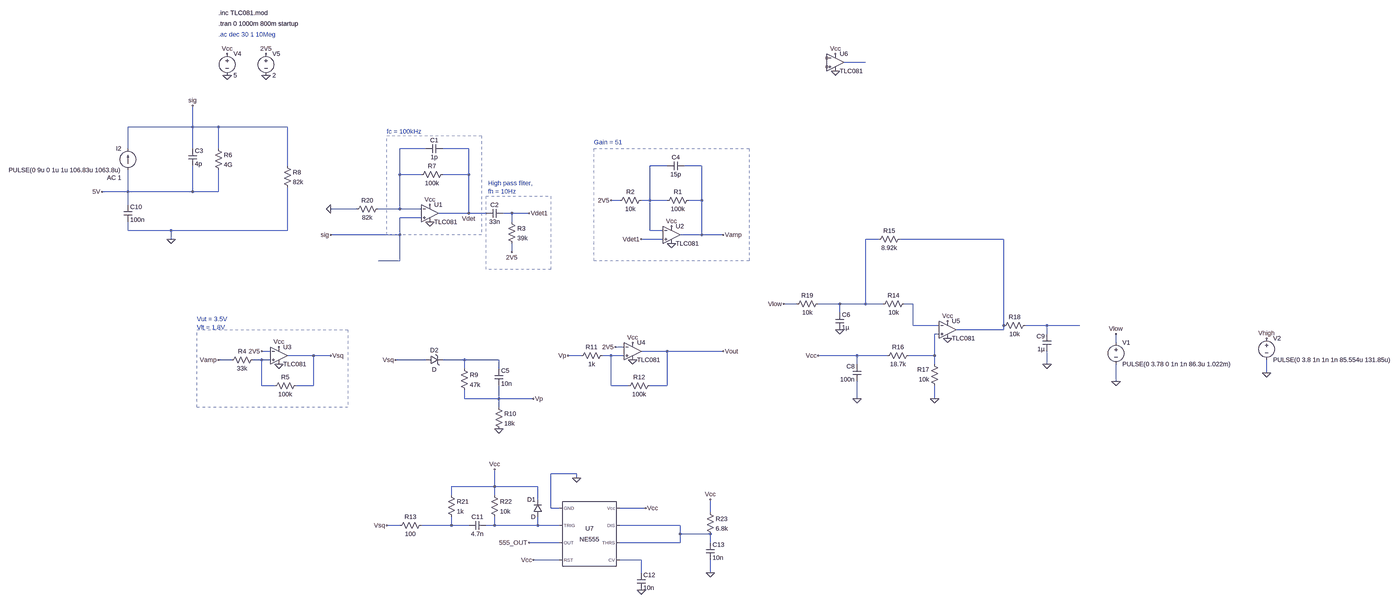
[diagram p0: schematic Receiver_updated - Alexander.asc, whole sheet]
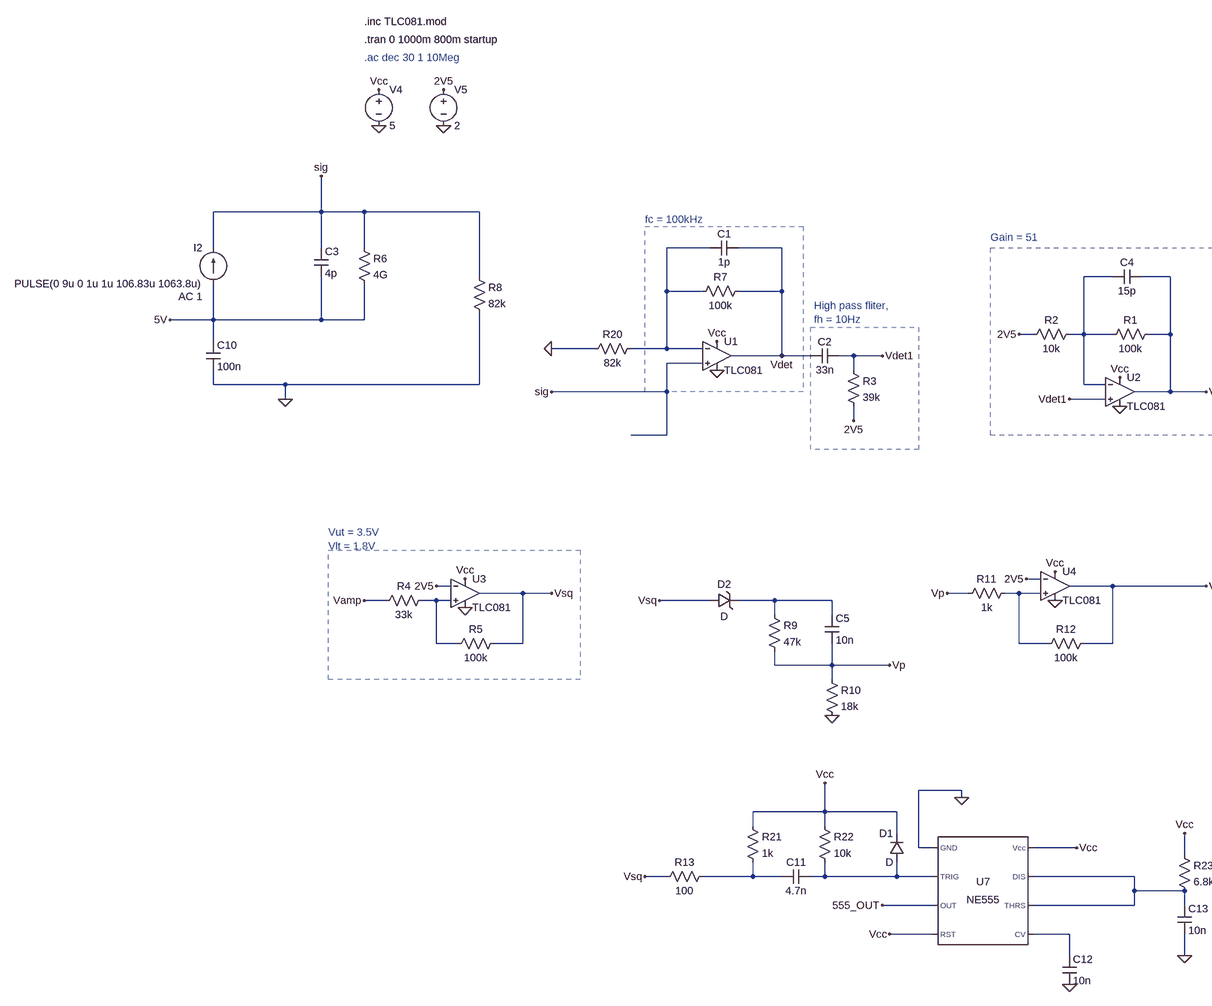
[diagram p1: schematic Receiver_updated - Alexander.asc, part, row 1 of 1, column 1 of 2]
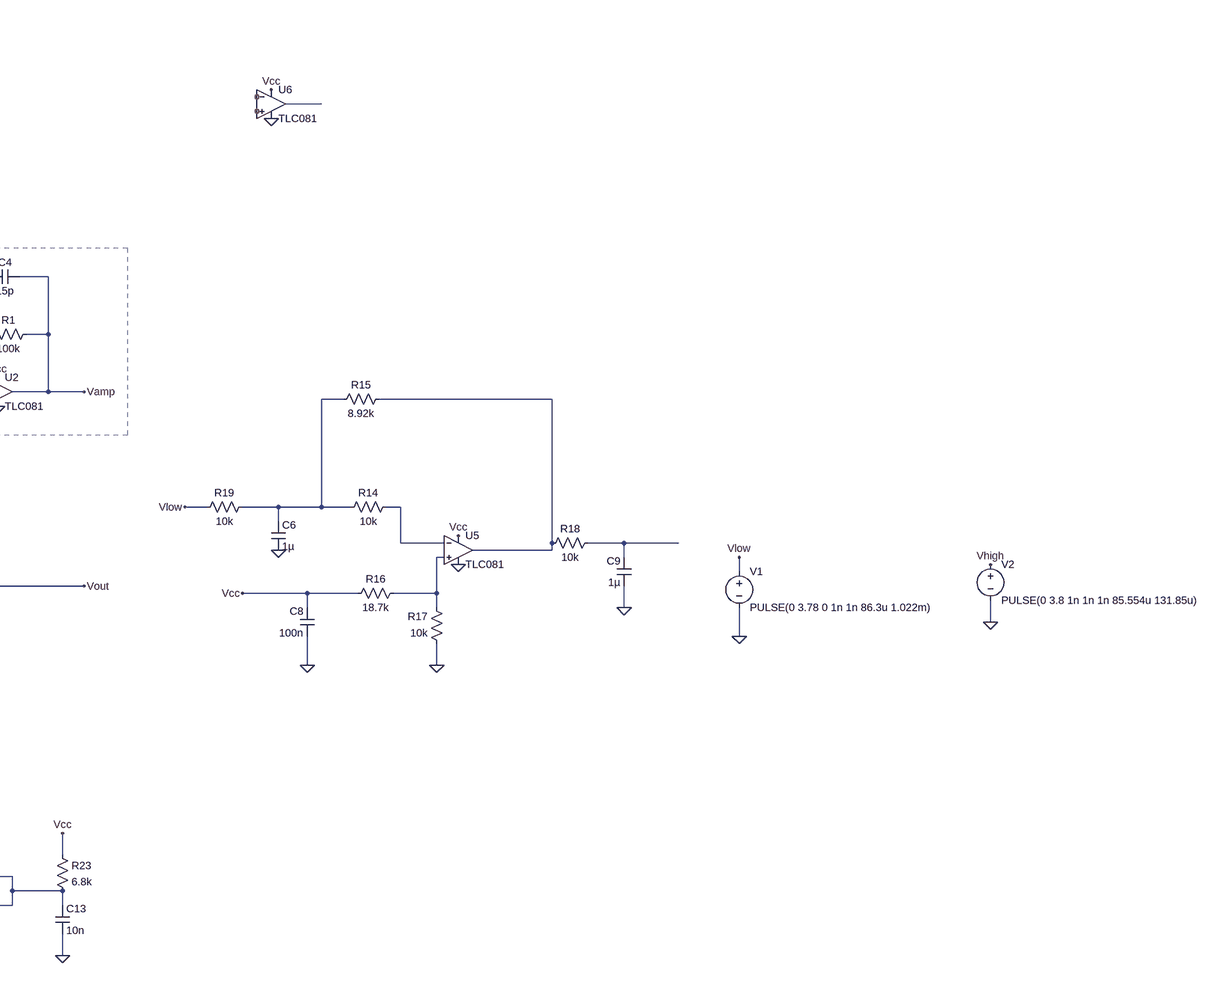
[diagram p2: schematic Receiver_updated - Alexander.asc, part, row 1 of 1, column 2 of 2]
Receiver_updated - Alexander.asc, the LTspice schematic file:
Version 4.1
SHEET 1 5412 2404
WIRE 1408 416 1328 416
WIRE -1088 656 -1088 576
WIRE -1088 656 -1328 656
WIRE -992 656 -1088 656
WIRE -736 656 -992 656
WIRE -1328 736 -1328 656
WIRE -1088 736 -1088 656
WIRE -992 736 -992 656
WIRE -224 736 -320 736
WIRE -64 736 -160 736
WIRE -736 800 -736 656
WIRE 672 800 608 800
WIRE 800 800 736 800
WIRE -320 832 -320 736
WIRE -240 832 -320 832
WIRE -64 832 -64 736
WIRE -64 832 -160 832
WIRE -1328 896 -1328 816
WIRE -1328 896 -1424 896
WIRE -1088 896 -1088 800
WIRE -1088 896 -1328 896
WIRE -992 896 -992 816
WIRE -992 896 -1088 896
WIRE 496 928 464 928
WIRE 608 928 608 800
WIRE 608 928 576 928
WIRE 672 928 608 928
WIRE 800 928 800 800
WIRE 800 928 752 928
WIRE -1328 944 -1328 896
WIRE -480 960 -576 960
WIRE -320 960 -320 832
WIRE -320 960 -400 960
WIRE -240 960 -320 960
WIRE -64 976 -64 832
WIRE -64 976 -176 976
WIRE 0 976 -64 976
WIRE 96 976 64 976
WIRE 160 976 96 976
WIRE -240 992 -320 992
WIRE 96 1008 96 976
WIRE -1328 1040 -1328 1008
WIRE -1168 1040 -1328 1040
WIRE -736 1040 -736 880
WIRE -736 1040 -1168 1040
WIRE 608 1040 608 928
WIRE 656 1040 608 1040
WIRE -320 1056 -320 992
WIRE -320 1056 -576 1056
WIRE 800 1056 800 928
WIRE 800 1056 720 1056
WIRE 880 1056 800 1056
WIRE -1168 1072 -1168 1040
WIRE 656 1072 576 1072
WIRE 1456 1072 1408 1072
WIRE 1984 1072 1536 1072
WIRE 96 1120 96 1088
WIRE -320 1152 -320 1056
WIRE -320 1152 -400 1152
WIRE 1152 1312 1104 1312
WIRE 1312 1312 1232 1312
WIRE 1408 1312 1408 1072
WIRE 1408 1312 1312 1312
WIRE 1472 1312 1408 1312
WIRE 1584 1312 1552 1312
WIRE 1312 1344 1312 1312
WIRE 1584 1392 1584 1312
WIRE 1680 1392 1584 1392
WIRE 1984 1392 1984 1072
WIRE 2144 1392 2064 1392
WIRE 2320 1392 2144 1392
WIRE 1984 1408 1984 1392
WIRE 1984 1408 1744 1408
WIRE 1680 1424 1664 1424
WIRE 2144 1424 2144 1392
WIRE 2480 1456 2480 1424
WIRE 512 1472 480 1472
WIRE -800 1488 -832 1488
WIRE 672 1488 576 1488
WIRE 880 1488 672 1488
WIRE -640 1504 -736 1504
WIRE -576 1504 -640 1504
WIRE 352 1504 304 1504
WIRE 464 1504 432 1504
WIRE 512 1504 464 1504
WIRE 1376 1504 1232 1504
WIRE 1488 1504 1376 1504
WIRE 1664 1504 1664 1424
WIRE 1664 1504 1568 1504
WIRE -944 1520 -992 1520
WIRE -832 1520 -864 1520
WIRE -800 1520 -832 1520
WIRE -224 1520 -336 1520
WIRE -80 1520 -160 1520
WIRE 48 1520 -80 1520
WIRE 1376 1536 1376 1504
WIRE 1664 1536 1664 1504
WIRE 2144 1536 2144 1488
WIRE -80 1552 -80 1520
WIRE 48 1552 48 1520
WIRE 3072 1568 3072 1520
WIRE 2480 1600 2480 1536
WIRE -832 1616 -832 1520
WIRE -784 1616 -832 1616
WIRE -640 1616 -640 1504
WIRE -640 1616 -704 1616
WIRE 464 1616 464 1504
WIRE 528 1616 464 1616
WIRE 672 1616 672 1488
WIRE 672 1616 608 1616
WIRE -80 1664 -80 1632
WIRE 48 1664 48 1616
WIRE 48 1664 -80 1664
WIRE 176 1664 48 1664
WIRE 1376 1664 1376 1600
WIRE 1664 1664 1664 1616
WIRE 48 1696 48 1664
WIRE 336 1952 240 1952
WIRE 336 1968 336 1952
WIRE 32 2000 32 1936
WIRE 32 2000 -128 2000
WIRE 192 2000 32 2000
WIRE -128 2032 -128 2000
WIRE 32 2032 32 2000
WIRE 192 2048 192 2000
WIRE 240 2080 240 1952
WIRE 272 2080 240 2080
WIRE 592 2080 496 2080
WIRE 832 2096 832 2048
WIRE -320 2144 -368 2144
WIRE -128 2144 -128 2112
WIRE -128 2144 -240 2144
WIRE -64 2144 -128 2144
WIRE 32 2144 32 2112
WIRE 32 2144 0 2144
WIRE 192 2144 192 2112
WIRE 192 2144 32 2144
WIRE 272 2144 192 2144
WIRE 720 2144 496 2144
WIRE 720 2176 720 2144
WIRE 832 2176 720 2176
WIRE 272 2208 160 2208
WIRE 720 2208 720 2176
WIRE 720 2208 496 2208
WIRE 832 2208 832 2176
WIRE 272 2272 176 2272
WIRE 576 2272 496 2272
WIRE 576 2320 576 2272
WIRE 832 2320 832 2272
FLAG -208 1008 0
FLAG -208 944 Vcc
FLAG -960 464 0
FLAG -960 384 Vcc
FLAG -816 464 0
FLAG -816 384 2V5
FLAG 464 928 2V5
FLAG 688 1088 0
FLAG 688 1024 Vcc
FLAG 576 1072 Vdet1
FLAG 96 1120 2V5
FLAG 160 976 Vdet1
FLAG -64 976 Vdet
FLAG 880 1056 Vamp
FLAG -768 1472 Vcc
FLAG -768 1536 0
FLAG -992 1520 Vamp
FLAG -832 1488 2V5
FLAG -576 1504 Vsq
FLAG 48 1776 0
FLAG -336 1520 Vsq
FLAG 176 1664 Vp
FLAG 304 1504 Vp
FLAG 480 1472 2V5
FLAG 544 1520 0
FLAG 544 1456 Vcc
FLAG -1088 576 sig
FLAG -576 960 0
FLAG -576 1056 sig
FLAG -1424 896 5V
FLAG -1168 1072 0
FLAG 880 1488 Vout
FLAG 1296 448 0
FLAG 1296 384 Vcc
FLAG 1376 1664 0
FLAG 1664 1664 0
FLAG 2144 1536 0
FLAG 1312 1408 0
FLAG 1712 1440 0
FLAG 1712 1376 Vcc
FLAG 1232 1504 Vcc
FLAG -368 2144 Vsq
FLAG 336 1968 0
FLAG 592 2080 Vcc
FLAG 32 1936 Vcc
FLAG 576 2384 0
FLAG 176 2272 Vcc
FLAG 160 2208 555_OUT
FLAG 832 2048 Vcc
FLAG 832 2320 0
FLAG 2480 1424 Vlow
FLAG 2480 1600 0
FLAG 3072 1440 Vhigh
FLAG 3072 1568 0
FLAG 1104 1312 Vlow
SYMBOL cap -1104 736 R0
SYMATTR InstName C3
SYMATTR Value 4p
SYMBOL res -1008 720 R0
SYMATTR InstName R6
SYMATTR Value 4G
SYMBOL res -144 816 R90
WINDOW 0 0 56 VBottom 2
WINDOW 3 32 56 VTop 2
SYMATTR InstName R7
SYMATTR Value 100k
SYMBOL voltage -960 368 R0
SYMATTR InstName V4
SYMATTR Value 5
SYMBOL voltage -816 368 R0
WINDOW 123 0 0 Left 0
WINDOW 39 0 0 Left 0
SYMATTR InstName V5
SYMATTR Value 2
SYMBOL cap -160 720 R90
WINDOW 0 0 32 VBottom 2
WINDOW 3 32 32 VTop 2
SYMATTR InstName C1
SYMATTR Value 1p
SYMBOL res 768 912 R90
WINDOW 0 0 56 VBottom 2
WINDOW 3 32 56 VTop 2
SYMATTR InstName R1
SYMATTR Value 100k
SYMBOL res 592 912 R90
WINDOW 0 0 56 VBottom 2
WINDOW 3 32 56 VTop 2
SYMATTR InstName R2
SYMATTR Value 10k
SYMBOL cap 64 960 R90
WINDOW 0 0 32 VBottom 2
WINDOW 3 32 32 VTop 2
SYMATTR InstName C2
SYMATTR Value 33n
SYMBOL res 80 992 R0
SYMATTR InstName R3
SYMATTR Value 39k
SYMBOL cap 736 784 R90
WINDOW 0 0 32 VBottom 2
WINDOW 3 32 32 VTop 2
SYMATTR InstName C4
SYMATTR Value 15p
SYMBOL res -848 1504 R90
WINDOW 0 0 56 VBottom 2
WINDOW 3 32 56 VTop 2
SYMATTR InstName R4
SYMATTR Value 33k
SYMBOL res -688 1600 R90
WINDOW 0 0 56 VBottom 2
WINDOW 3 32 56 VTop 2
SYMATTR InstName R5
SYMATTR Value 100k
SYMBOL zener -224 1536 R270
WINDOW 0 36 32 VTop 2
WINDOW 3 -4 32 VBottom 2
SYMATTR InstName D2
SYMBOL res -96 1536 R0
SYMATTR InstName R9
SYMATTR Value 47k
SYMBOL cap 32 1552 R0
SYMATTR InstName C5
SYMATTR Value 10n
SYMBOL res 32 1680 R0
SYMATTR InstName R10
SYMATTR Value 18k
SYMBOL res 448 1488 R90
WINDOW 0 0 56 VBottom 2
WINDOW 3 32 56 VTop 2
SYMATTR InstName R11
SYMATTR Value 1k
SYMBOL res 624 1600 R90
WINDOW 0 0 56 VBottom 2
WINDOW 3 32 56 VTop 2
SYMATTR InstName R12
SYMATTR Value 100k
SYMBOL OpAmps\\opamp2 -208 912 R0
SYMATTR InstName U1
SYMATTR Value TLC081
SYMBOL OpAmps\\opamp2 688 992 R0
SYMATTR InstName U2
SYMATTR Value TLC081
SYMBOL OpAmps\\opamp2 -768 1440 R0
SYMATTR InstName U3
SYMATTR Value TLC081
SYMBOL OpAmps\\opamp2 544 1424 R0
SYMATTR InstName U4
SYMATTR Value TLC081
SYMBOL res -384 944 R90
WINDOW 0 0 56 VBottom 2
WINDOW 3 32 56 VTop 2
SYMATTR InstName R20
SYMATTR Value 82k
SYMBOL current -1328 816 R180
WINDOW 0 24 80 Left 2
WINDOW 3 24 0 Left 2
WINDOW 123 24 -28 Left 2
WINDOW 39 0 0 Left 0
SYMATTR InstName I2
SYMATTR Value PULSE(0 9u 0 1u 1u 106.83u 1063.8u)
SYMATTR Value2 AC 1
SYMBOL cap -1344 944 R0
SYMATTR InstName C10
SYMATTR Value 100n
SYMBOL res -752 784 R0
SYMATTR InstName R8
SYMATTR Value 82k
SYMBOL OpAmps\\opamp2 1296 352 R0
SYMATTR InstName U6
SYMATTR Value TLC081
SYMBOL OpAmps\\opamp2 1712 1344 R0
SYMATTR InstName U5
SYMATTR Value TLC081
SYMBOL res 1568 1296 R90
WINDOW 0 0 56 VBottom 2
WINDOW 3 32 56 VTop 2
SYMATTR InstName R14
SYMATTR Value 10k
SYMBOL res 1552 1056 R90
WINDOW 0 0 56 VBottom 2
WINDOW 3 32 56 VTop 2
SYMATTR InstName R15
SYMATTR Value 8.92k
SYMBOL res 1584 1488 R90
WINDOW 0 0 56 VBottom 2
WINDOW 3 32 56 VTop 2
SYMATTR InstName R16
SYMATTR Value 18.7k
SYMBOL res 1680 1632 R180
WINDOW 0 36 76 Left 2
WINDOW 3 36 40 Left 2
SYMATTR InstName R17
SYMATTR Value 10k
SYMBOL res 1968 1408 R270
WINDOW 0 32 56 VTop 2
WINDOW 3 0 56 VBottom 2
SYMATTR InstName R18
SYMATTR Value 10k
SYMBOL res 1136 1328 R270
WINDOW 0 32 56 VTop 2
WINDOW 3 0 56 VBottom 2
SYMATTR InstName R19
SYMATTR Value 10k
SYMBOL cap 1296 1344 R0
SYMATTR InstName C6
SYMATTR Value 1µ
SYMBOL cap 1392 1600 R180
WINDOW 0 24 56 Left 2
WINDOW 3 24 8 Left 2
SYMATTR InstName C8
SYMATTR Value 100n
SYMBOL cap 2160 1488 R180
WINDOW 0 24 56 Left 2
WINDOW 3 24 8 Left 2
SYMATTR InstName C9
SYMATTR Value 1µ
SYMBOL res -224 2128 R90
WINDOW 0 0 56 VBottom 2
WINDOW 3 32 56 VTop 2
SYMATTR InstName R13
SYMATTR Value 100
SYMBOL res -144 2016 R0
SYMATTR InstName R21
SYMATTR Value 1k
SYMBOL cap 0 2128 R90
WINDOW 0 0 32 VBottom 2
WINDOW 3 32 32 VTop 2
SYMATTR InstName C11
SYMATTR Value 4.7n
SYMBOL diode 208 2112 R180
WINDOW 0 24 64 Left 2
WINDOW 3 24 0 Left 2
SYMATTR InstName D1
SYMBOL Misc\\NE555 384 2176 R0
SYMATTR InstName U7
SYMBOL cap 560 2320 R0
SYMATTR InstName C12
SYMATTR Value 10n
SYMBOL res 816 2080 R0
SYMATTR InstName R23
SYMATTR Value 6.8k
SYMBOL cap 816 2208 R0
SYMATTR InstName C13
SYMATTR Value 10n
SYMBOL res 16 2016 R0
SYMATTR InstName R22
SYMATTR Value 10k
SYMBOL voltage 2480 1440 R0
WINDOW 123 0 0 Left 0
WINDOW 39 0 0 Left 0
SYMATTR InstName V1
SYMATTR Value PULSE(0 3.78 0 1n 1n 86.3u 1.022m)
SYMBOL voltage 3072 1424 R0
WINDOW 123 0 0 Left 0
WINDOW 39 0 0 Left 0
SYMATTR InstName V2
SYMATTR Value PULSE(0 3.8 1n 1n 1n 85.554u 131.85u)
TEXT -992 272 Left 2 !.tran 0 1000m 800m startup
TEXT -992 232 Left 2 !.inc TLC081.mod
TEXT -368 672 Left 2 ;fc = 100kHz
TEXT 8 864 Left 2 ;High pass fliter,\nfh = 10Hz
TEXT 400 712 Left 2 ;Gain = 51
TEXT -992 312 Left 2 ;.ac dec 30 1 10Meg
TEXT -1072 1368 Left 2 ;Vut = 3.5V\nVlt = 1.8V
RECTANGLE Normal -16 1056 -368 688 2
RECTANGLE Normal 240 1184 0 912 2
RECTANGLE Normal 976 1152 400 736 2
RECTANGLE Normal -512 1696 -1072 1408 2

The netlist it stands for:
* Receiver_updated - Alexander.asc
C3 sig 5V 4p
R6 sig 5V 4G
R7 Vdet N002 100k
V4 Vcc 0 5
V5 2V5 0 2
C1 Vdet N002 1p
R1 Vamp N003 100k
R2 N003 2V5 10k
C2 Vdet1 Vdet 33n
R3 Vdet1 2V5 39k
C4 Vamp N003 15p
R4 N010 Vamp 33k
R5 Vsq N010 100k
D2 Vsq N011 D
R9 N011 Vp 47k
C5 N011 Vp 10n
R10 Vp 0 18k
R11 N009 Vp 1k
R12 Vout N009 100k
X§U1 sig N002 Vcc 0 Vdet TLC081  ; pins In+ In- V+ V- OUT
X§U2 Vdet1 N003 Vcc 0 Vamp TLC081  ; pins In+ In- V+ V- OUT
X§U3 N010 2V5 Vcc 0 Vsq TLC081  ; pins In+ In- V+ V- OUT
X§U4 N009 2V5 Vcc 0 Vout TLC081  ; pins In+ In- V+ V- OUT
R20 N002 0 82k
I2 5V sig PULSE(0 9u 0 1u 1u 106.83u 1063.8u) AC 1
C10 5V 0 100n
R8 sig 0 82k
X§U6 NC_01 NC_02 Vcc 0 N001 TLC081  ; pins In+ In- V+ V- OUT
X§U5 N008 N006 Vcc 0 N005 TLC081  ; pins In+ In- V+ V- OUT
R14 N006 N004 10k
R15 N005 N004 8.92k
R16 N008 Vcc 18.7k
R17 0 N008 10k
R18 N005 N007 10k
R19 Vlow N004 10k
C6 N004 0 1µ
C8 0 Vcc 100n
C9 0 N007 1µ
R13 N012 Vsq 100
R21 Vcc N012 1k
C11 N013 N012 4.7n
D1 N013 Vcc D
X§U7 0 N013 555_OUT Vcc N015 N014 N014 Vcc NE555  ; pins GND TRIG OUT RST CV THRS DIS Vcc
C12 N015 0 10n
R23 Vcc N014 6.8k
C13 N014 0 10n
R22 Vcc N013 10k
V1 Vlow 0 PULSE(0 3.78 0 1n 1n 86.3u 1.022m)
V2 Vhigh 0 PULSE(0 3.8 1n 1n 1n 85.554u 131.85u)
.model D D
.lib standard.dio
.tran 0 1000m 800m startup
.inc TLC081.mod
* fc = 100kHz
* High pass fliter,
* fh = 10Hz
* Gain = 51
* .ac dec 30 1 10Meg
* Vut = 3.5V
* Vlt = 1.8V
.lib NE555.sub
.backanno
.end